# EAGLE schematic kitcop4 (EAGLE 6.1)
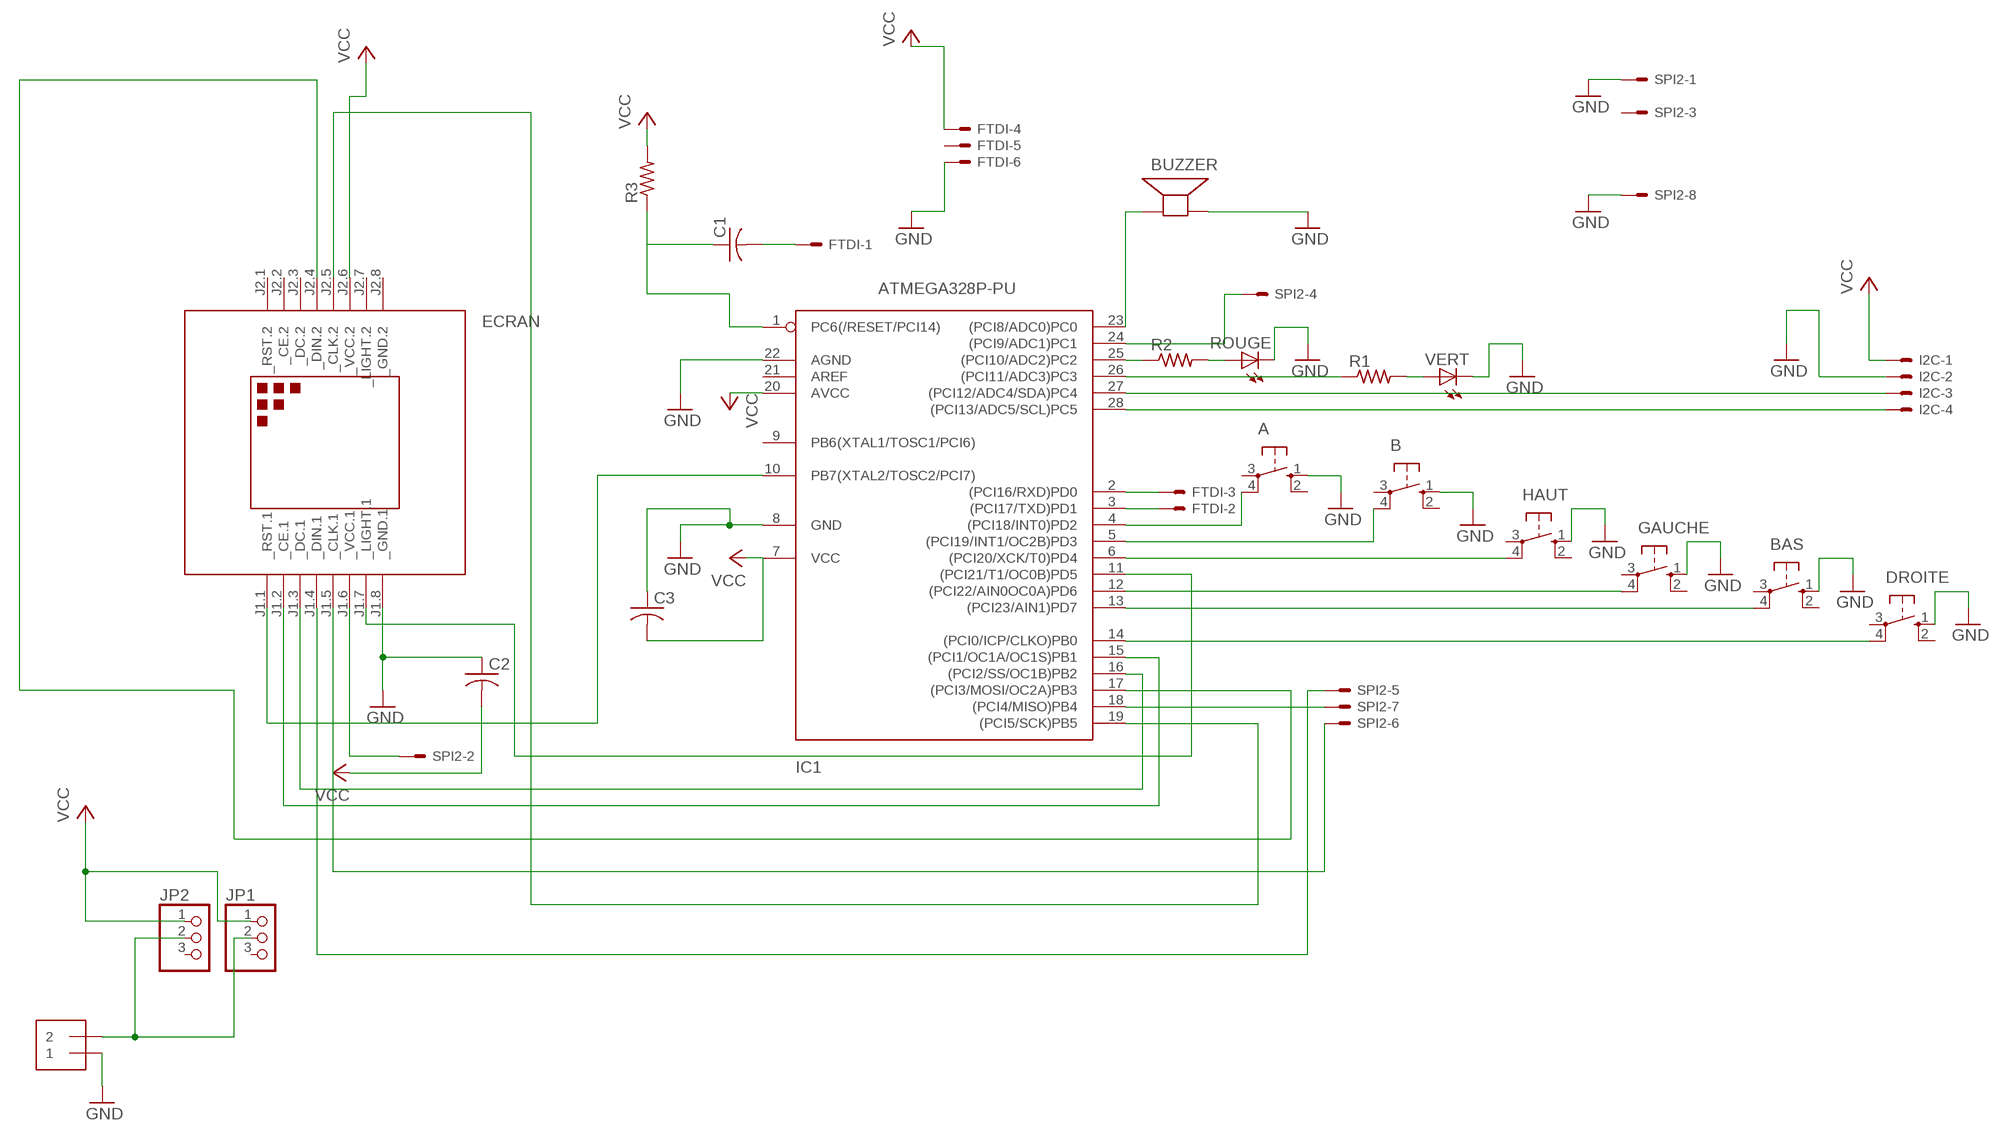
[diagram p0: schematic, sheet 1]

## Parts
A  10-XX  [B3F-10XX]
B  10-XX  [B3F-10XX]
BAS  10-XX  [B3F-10XX]
BUZZER  SPEAKER/AL60P  [AL60P]
C1  C-US025-040X050  [C025-040X050]
C2  C-US025-040X050  [C025-040X050]
C3  C-US025-040X050  [C025-040X050]
DROITE  10-XX  [B3F-10XX]
ECRAN  DISPLAY-NOKIA-3310  [DISPLAY-NOKIA-3310]
FTDI  22-23-2061  [22-23-2061]
GAUCHE  10-XX  [B3F-10XX]
HAUT  10-XX  [B3F-10XX]
I2C  22-23-2041  [22-23-2041]
IC1  ATMEGA328P-PU  ATMEGA168V-10P  [DIL28-3]
J1  1X2-3.5MM  [1X2-3.5MM]
JP1  PINHD-1X3  [1X03]
JP2  PINHD-1X3  [1X03]
R1  R-US_0207/10  [0207/10]
R2  R-US_0207/10  [0207/10]
R3  R-US_0207/10  [0207/10]
ROUGE  LED5MM  [LED5MM]
SPI2  22-23-2081  [22-23-2081]
VERT  LED5MM  [LED5MM]

## Nets
GND: A.1(S) B.1(S) BAS.1(S) BUZZER.2(-) C2.1 C3.1 DROITE.1(S) ECRAN.J1.8(_GND.1) FTDI.6 GAUCHE.1(S) HAUT.1(S) I2C.2 IC1.8(GND) IC1.22(AGND) J1.1 ROUGE.K(C) SPI2.1 SPI2.8 VERT.K(C)
N$1: A.4(P1) IC1.4((PCI18/INT0)PD2)
N$2: B.4(P1) IC1.5((PCI19/INT1/OC2B)PD3)
N$3: ECRAN.J1.7(_LIGHT.1) IC1.11((PCI21/T1/OC0B)PD5)
N$4: GAUCHE.4(P1) IC1.12((PCI22/AIN0OC0A)PD6)
N$5: BAS.4(P1) IC1.13((PCI23/AIN1)PD7)
N$6: DROITE.4(P1) IC1.14((PCI0/ICP/CLKO)PB0)
N$7: I2C.3 IC1.27((PCI12/ADC4/SDA)PC4)
N$8: I2C.4 IC1.28((PCI13/ADC5/SCL)PC5)
N$9: J1.2 JP1.2 JP2.2
N$10: HAUT.4(P1) IC1.6((PCI20/XCK/T0)PD4)
N$11: FTDI.2 IC1.3((PCI17/TXD)PD1)
N$12: IC1.26((PCI11/ADC3)PC3) R1.1
N$13: R1.2 VERT.A
N$14: IC1.25((PCI10/ADC2)PC2) R2.1
N$15: R2.2 ROUGE.A
N$16: IC1.24((PCI9/ADC1)PC1) SPI2.4
N$17: ECRAN.J2.4(_DIN.2) IC1.17((PCI3/MOSI/OC2A)PB3)
N$18: ECRAN.J2.5(_CLK.2) IC1.19((PCI5/SCK)PB5)
N$19: ECRAN.J1.2(_CE.1) IC1.15((PCI1/OC1A/OC1S)PB1)
N$20: ECRAN.J1.3(_DC.1) IC1.16((PCI2/SS/OC1B)PB2)
N$21: FTDI.3 IC1.2((PCI16/RXD)PD0)
N$22: IC1.18((PCI4/MISO)PB4) SPI2.7
N$23: BUZZER.1(+) IC1.23((PCI8/ADC0)PC0)
N$24: ECRAN.J1.4(_DIN.1) SPI2.5
N$25: C1.2 FTDI.1
N$26: ECRAN.J1.5(_CLK.1) SPI2.6
N$27: ECRAN.J1.6(_VCC.1) SPI2.2
N$29: C1.1 IC1.1(PC6(/RESET/PCI14)) R3.1
N$30: ECRAN.J1.1(_RST.1) IC1.10(PB7(XTAL2/TOSC2/PCI7))
VCC: C2.2 C3.2 ECRAN.J2.6(_VCC.2) FTDI.4 I2C.1 IC1.7(VCC) IC1.20(AVCC) JP1.1 JP2.1 R3.2
Unconnected: A.2(S1) A.3(P) B.2(S1) B.3(P) BAS.2(S1) BAS.3(P) DROITE.2(S1) DROITE.3(P) ECRAN.J2.3(_DC.2) ECRAN.J2.7(_LIGHT.2) ECRAN.J2.8(_GND.2) FTDI.5 GAUCHE.2(S1) GAUCHE.3(P) HAUT.2(S1) HAUT.3(P) IC1.9(PB6(XTAL1/TOSC1/PCI6)) IC1.21(AREF) JP1.3 JP2.3 SPI2.3

## Power pins joined to a net without a drawn wire
_CE.2: ECRAN.J2.2(_CE.2)
_RST.2: ECRAN.J2.1(_RST.2)

## Library data of the parts
A B BAS DROITE GAUCHE HAUT = switch-omron:10-XX: OMRON SWITCH; MPN: B3F-1000; OC_FARNELL: 176432; OC_NEWARK: 36M3542
BUZZER = adafruit:SPEAKER: SPEAKER Source: Buerklin Added PS12 (for part # PS1240 piezo) http://www.ladyada.net/library/pcb/eaglelibrary.html
C1-C3 = adafruit:C-US: CAPACITOR, American symbol
ECRAN = FJlib:DISPLAY-NOKIA-3310: 84x48 Dot Matrix LCD Module based on Nokia 3310 display
FTDI = con-molex:22-23-2061: .100" (2.54mm) Center Header - 6 Pin; MF: MOLEX; MPN: 22-23-2061; OC_FARNELL: 1462922; OC_NEWARK: 27C1933
I2C = con-molex:22-23-2041: .100" (2.54mm) Center Header - 4 Pin; MF: MOLEX; MPN: 22-23-2041; OC_FARNELL: 1462920; OC_NEWARK: 38C0355
IC1 = adafruit:ATMEGA168*P: MICROCONTROLLER 16 kBytes FLASH 1 kBytes SRAM 512 Bytes EEPROM USART 8-channel 10 bit ADC
J1 = adafruit:1X2: 3.5mm Terminal block http://www.ladyada.net/library/pcb/eaglelibrary.html
JP1 JP2 = adafruit:PINHD-1X3: PIN HEADER
R1-R3 = adafruit:R-US_: RESISTOR, American symbol
ROUGE VERT = adafruit:LED: LED OSRAM: - CHIPLED LG R971, LG N971, LY N971, LG Q971, LY Q971, LO R971, LY R971 LH N974, LH R974 LS Q976, LO Q976, LY Q976 LO Q996 - Hyper CHIPLED LW Q18S LB Q993, LB Q99A, LB R99A - SideLED LS A670, LO A670, LY A670, LG A670, LP A670 LB A673, LV A673, LT A673, LW A673 LH A674 LY A675 LS A676, LA A676, LO A676, LY A676, LW A676 LS A679, LY A679, LG A679 - Hyper Micro SIDELED® LS Y876, LA Y876, LO Y876, LY Y876 LT Y87S - SmartLED LW L88C, LW L88S LB L89C, LB L89S, LG L890 LS L89K, LO L89K, LY L89K LS L896, LA L896, LO L896, LY L896 - TOPLED LS T670, LO T670, LY T670, LG T670, LP T670 LSG T670, LSP T670, LSY T670, LOP T670, LYG T670 LG T671, LOG T671, LSG T671 LB T673, LV T673, LT T673, LW T673 LH T674 LS T676, LA T676, LO T676, LY T676, LB T676, LH T676, LSB T676, LW T676 LB T67C, LV T67C, LT T67C, LS T67K, LO T67K, LY T67K, LW E67C LS E67B, LA E67B, LO E67B, LY E67B, LB E67C, LV E67C, LT E67C LW T67C LS T679, LY T679, LG T679 LS T770, LO T770, LY T770, LG T770, LP T770 LB T773, LV T773, LT T773, LW T773 LH T774 LS E675, LA E675, LY E675, LS T675 LS T776, LA T776, LO T776, LY T776, LB T776 LHGB T686 LT T68C, LB T68C - Hyper Mini TOPLED® LB M676 - Mini TOPLED Santana® LG M470 LS M47K, LO M47K, LY M47K Source: http://www.osram.convergy.de/
SPI2 = con-molex:22-23-2081: .100" (2.54mm) Center Header - 8 Pin; MF: MOLEX; MPN: 22-23-2081; OC_FARNELL: 1756826; OC_NEWARK: 01C7592